# Altium schematic sheet TopSheet.SchDoc
size A4; CompanyName: Technische Hochschule Nürnberg Georg Simon Ohm; Organization: UltraZohm; Address1: Kesslerplatz 12; Address2: 90489 Nürnberg; Address3: GERMANY; DocumentNumber: 1; SheetNumber: 1; SheetTotal: 5; Website: www.ultrazohm.com
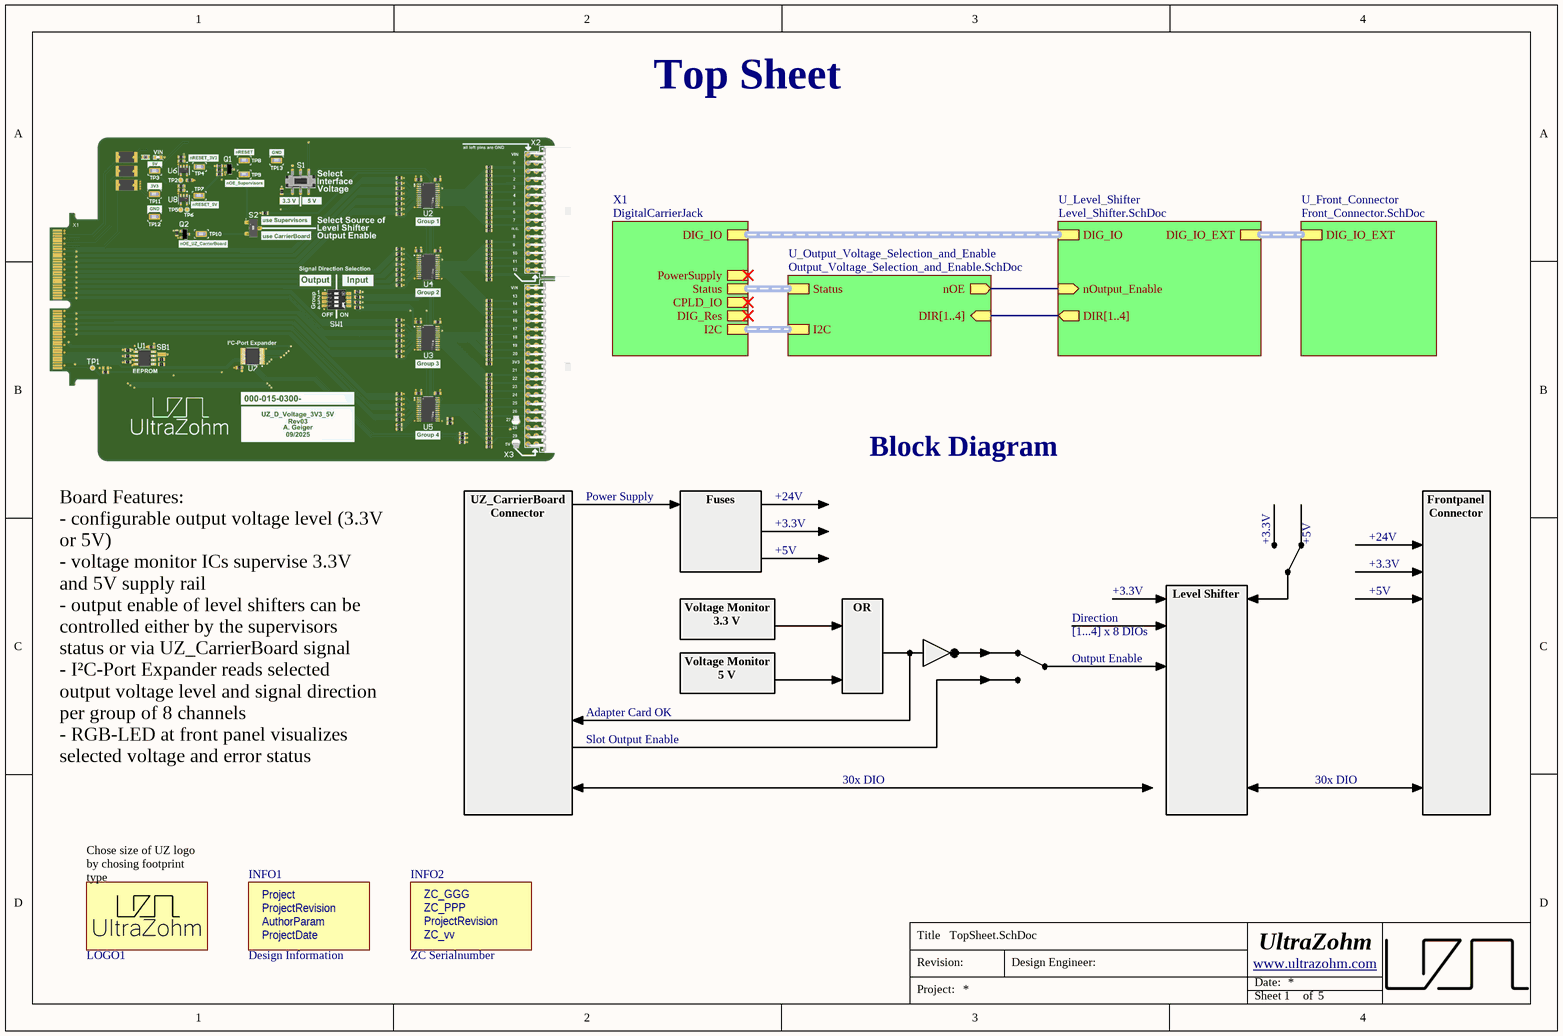
[diagram p0: TopSheet.SchDoc]

## Parts
INFO1  Design Information  [Design_info]  (no BOM)
INFO2  ZC Serialnumber  [ZC-Serial]  (no BOM)
LOGO1  UZ Logo  [UZ_Logo_small]  (value not drawn)  (no BOM)

## Sub-sheets
U_Front_Connector = Front_Connector.SchDoc: DIG_IO_EXT (harness DigCon_DIG_IO_EXT)
U_Level_Shifter = Level_Shifter.SchDoc: DIG_IO (harness DigCon_DIG_IO), DIG_IO_EXT (harness DigCon_DIG_IO_EXT), nOutput_Enable (in), DIR[1..4] (out)
U_Output_Voltage_Selection_and_Enable = Output_Voltage_Selection_and_Enable.SchDoc: Status (harness DigCon_Status), nOE (out), I2C (harness DigCon_I2C), DIR[1..4] (in)
X1 = DigitalCarrierJack: DIG_IO (harness DigCon_DIG_IO), PowerSupply (harness DigCon_PowerSupply), DIG_Res (harness DigCon_DIG_Res), CPLD_IO (harness DigCon_DCPLD_IO), Status (harness DigCon_Status), I2C (harness DigCon_I2C)

## Nets
(unnamed): sheet U_Level_Shifter/nOutput_Enable, sheet U_Output_Voltage_Selection_and_Enable/nOE

## Buses and harness runs
bus sheet U_Level_Shifter/DIR[1..4] = sheet U_Output_Voltage_Selection_and_Enable/DIR[1..4]
harness sheet U_Front_Connector/DIG_IO_EXT = sheet U_Level_Shifter/DIG_IO_EXT
harness sheet U_Level_Shifter/DIG_IO = sheet X1/DIG_IO
harness sheet U_Output_Voltage_Selection_and_Enable/I2C = sheet X1/I2C
harness sheet U_Output_Voltage_Selection_and_Enable/Status = sheet X1/Status

## Notes on the sheet
- Top Sheet
- Power Supply
- +24V
- Block Diagram
- Fuses
- +3.3V
- +5V
- Voltage Monitor
  3.3 V
- Direction
- [1...4] x 8 DIOs
- Adapter Card OK
- Voltage Monitor
  5 V
- OR
- Output Enable
- Slot Output Enable
- 30x DIO
- Board Features:
  - configurable output voltage level (3.3V or 5V)
  - voltage monitor ICs supervise 3.3V and 5V supply rail
  - output enable of level shifters can be controlled either by the supervisors status or via UZ_CarrierBoard signal
  - I²C-Port Expander reads selected output voltage level and signal direction per group of 8 channels
  - RGB-LED at front panel visualizes selected voltage and error status
- UZ_CarrierBoard
  Connector
- Level Shifter
- Frontpanel
  Connector
- (near LOGO1) Chose size of UZ logo by chosing footprint type
- Title
- Revision:
- Design Engineer:
- Date:
- Project:
- Sheet
- of
- (in symbol Design_info) Project; ProjectRevision; AuthorParam; ProjectDate
- (in symbol ZC-Serial) ZC_GGG; ZC_PPP; ProjectRevision; ZC_vv

## Library data of the parts
INFO1 = Design_info
INFO2 = ZC-Serial: Manufacturer: UltraZohm; Value: GGG-PPP-VVvv; Created from: FRosner; Manufacturer Part Number: ZC-Serial; PartID: 58; Created On: 15.04.2025 09:17:14; ComponentLink1Description: https://docs.ultrazohm.com/; ComponentLink1URL: homepage; Component Type: ZC Serialnumber; Last Updated: 15.04.2025 09:17:14; Supplier 1: -; Supplier Part Number 1: -; Type: Serial Number; Live Cycle Status: 1
LOGO1 = 1: Official Project Logo of the UltraZohm; Manufacturer: PCB Manufacturer; Manufacturer Part Number: UltraZohm Logo; Created from: T. Wendt; PartID: 1; Created On: 19.02.2021 16:55:56; ComponentLink1Description: Homepage; ComponentLink1URL: https://ultrazohm.com; Component Type: Logo; Last Updated: 02.03.2021 14:31:24; Type: Standard (No BOM); Live Cycle Status: 1